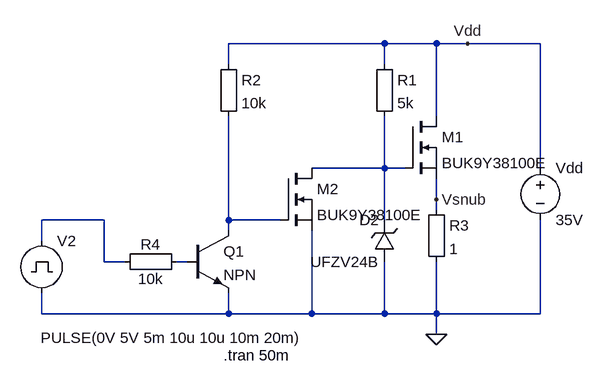
[diagram p0: schematic airbag-1.asc]
airbag-1.asc, the LTspice schematic file:
Version 4
SHEET 1 880 680
WIRE 176 32 -64 32
WIRE 256 32 176 32
WIRE 304 32 256 32
WIRE 416 32 304 32
WIRE -64 64 -64 32
WIRE 176 64 176 32
WIRE 256 144 256 32
WIRE 176 224 176 144
WIRE 176 224 64 224
WIRE 208 224 176 224
WIRE 416 224 416 32
WIRE 256 272 256 240
WIRE 256 288 256 272
WIRE -256 304 -352 304
WIRE -64 304 -64 144
WIRE 16 304 -64 304
WIRE 176 304 176 224
WIRE -64 320 -64 304
WIRE -352 336 -352 304
WIRE -256 368 -256 304
WIRE -224 368 -256 368
WIRE -128 368 -144 368
WIRE -352 448 -352 416
WIRE -64 448 -64 416
WIRE -64 448 -352 448
WIRE 64 448 64 320
WIRE 64 448 -64 448
WIRE 176 448 176 368
WIRE 176 448 64 448
WIRE 256 448 256 368
WIRE 256 448 176 448
WIRE 416 448 416 304
WIRE 416 448 256 448
WIRE 256 480 256 448
FLAG 256 480 0
FLAG 256 272 Vsnub
FLAG 304 32 Vdd
SYMBOL voltage 416 208 R0
WINDOW 123 0 0 Left 0
WINDOW 39 0 0 Left 0
SYMATTR InstName Vdd
SYMATTR Value 35V
SYMBOL nmos 208 144 R0
SYMATTR InstName M1
SYMATTR Value BUK9Y38100E
SYMBOL Misc\\EuropeanResistor 160 48 R0
SYMATTR InstName R1
SYMATTR Value 5k
SYMBOL zener 192 368 R180
WINDOW 0 24 64 Left 2
WINDOW 3 24 0 Left 2
SYMATTR InstName D2
SYMATTR Value UFZV24B
SYMATTR Description Diode
SYMATTR Type diode
SYMBOL pulse -352 320 R0
WINDOW 3 -1 165 Left 2
WINDOW 123 0 0 Left 0
WINDOW 39 0 0 Left 0
SYMATTR Value PULSE(0V 5V 5m 10u 10u 10m 20m)
SYMATTR InstName V2
SYMBOL Misc\\EuropeanResistor 240 272 R0
SYMATTR InstName R3
SYMATTR Value 1
SYMBOL nmos 16 224 R0
SYMATTR InstName M2
SYMATTR Value BUK9Y38100E
SYMBOL npn -128 320 R0
SYMATTR InstName Q1
SYMBOL Misc\\EuropeanResistor -80 48 R0
SYMATTR InstName R2
SYMATTR Value 10k
SYMBOL Misc\\EuropeanResistor -128 352 R90
WINDOW 0 5 56 VBottom 2
WINDOW 3 27 56 VTop 2
SYMATTR InstName R4
SYMATTR Value 10k
TEXT -72 512 Left 2 !.tran 50m

The netlist it stands for:
* airbag-1.asc
Vdd Vdd 0 35V
M1 Vdd N001 Vsnub Vsnub BUK9Y38100E
R1 Vdd N001 5k
D2 0 N001 UFZV24B
V2 N002 0 PULSE(0V 5V 5m 10u 10u 10m 20m)
R3 Vsnub 0 1
M2 N001 N003 0 0 BUK9Y38100E
Q1 N003 N004 0 0 NPN
R2 Vdd N003 10k
R4 N004 N002 10k
.model D D
.lib standard.dio
.model NPN NPN
.model PNP PNP
.lib standard.bjt
.model NMOS NMOS
.model PMOS PMOS
.lib standard.mos
.tran 50m
.backanno
.end